# EAGLE design Ver1.0 (EAGLE 9.6.2)
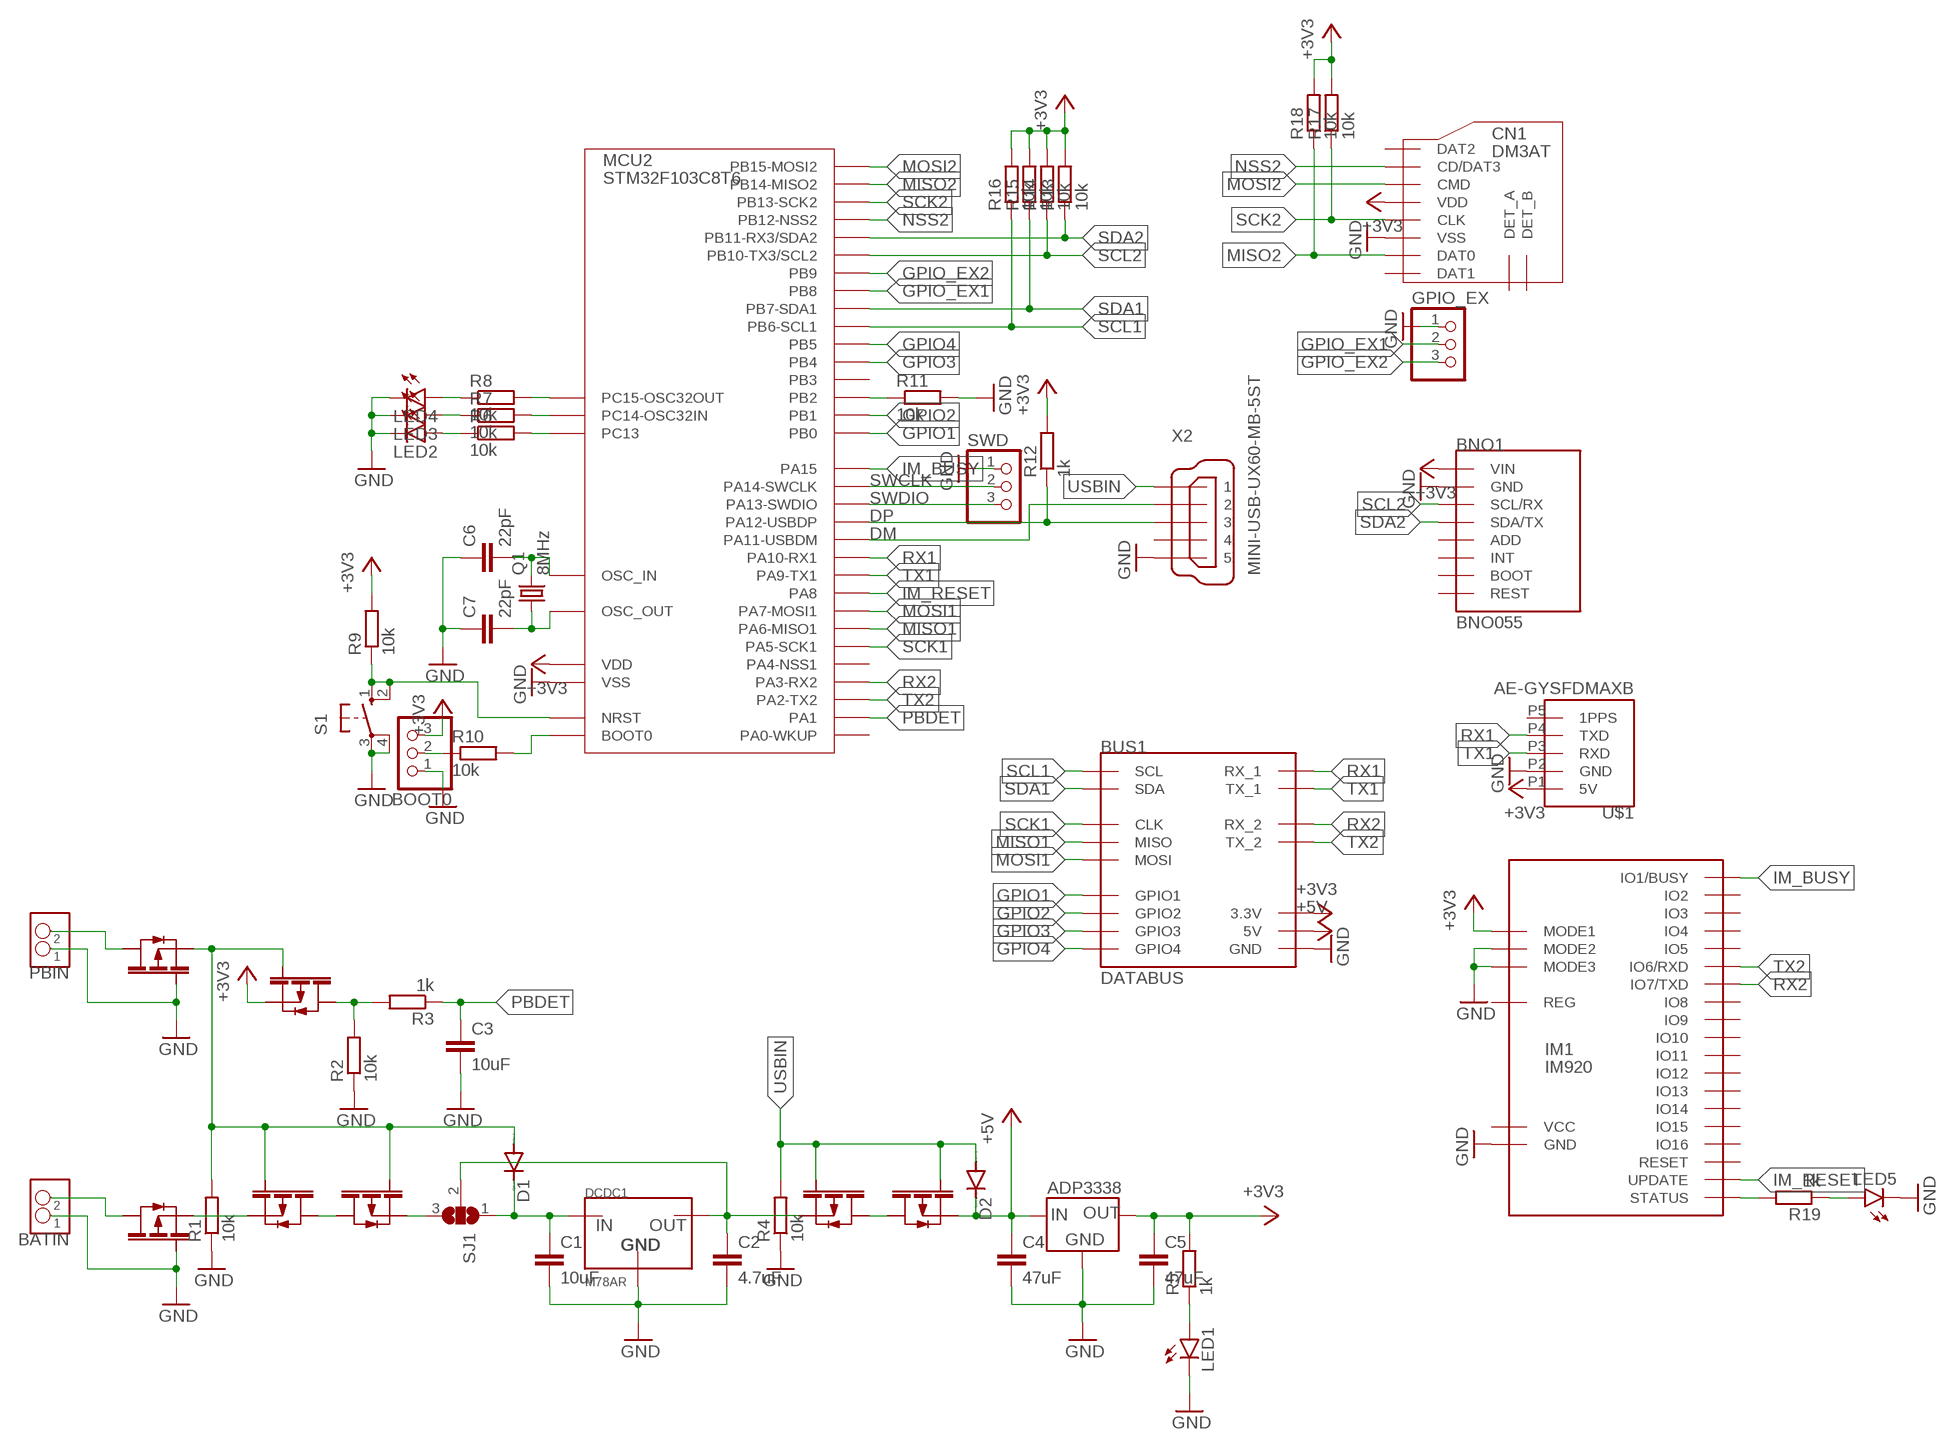
[diagram p0: schematic, sheet 1]

## Parts
BATIN  S2B-XH-A  [S2B-XH-A]
BNO1  BNO055  [BNO055]
BOOT0  PINHD-1X3/90  [1X03/90]
BUS1  DATABUS  [8X2]
C1  10uF  C-EUC2012  [C2012]
C2  4.7uF  C-EUC2012  [C2012]
C3  10uF  C-EUC2012  [C2012]
C4  47uF  C-EUC2012  [C2012]
C5  47uF  C-EUC2012  [C2012]
C6  22pF  C-EUC2012  [C2012]
C7  22pF  C-EUC2012  [C2012]
CN1  DM3AT  [DM3AT]
D1  DIODE-SOD123  [SOD123]
D2  DIODE-SOD123  [SOD123]
DCDC1  M78AR  [M78AR]
FET1  PCH  [SOT-23]
FET2  PCH  [SOT-23]
FET3  PCH  [SOT-23]
FET4  PCH  [SOT-23]
FET5  PCH  [SOT-23]
FET6  PCH  [SOT-23]
FET7  PCH  [SOT-23]
GPIO_EX  PINHD-1X3  [1X03]
IC1  ADP3338-3.3  [SOT-223]
IM1  IM920  [IM920]
LED1  LEDSMT1206  [1206]
LED2  LEDSMT1206  [1206]
LED3  LEDSMT1206  [1206]
LED4  LEDSMT1206  [1206]
LED5  LEDSMT1206  [1206]
MCU2  STM32F103C8T6  [LQFP48]
PBIN  S2B-XH-A  [S2B-XH-A]
Q1  8MHz  CRYSTALHC49S  [HC49/S]
R1  10k  R-EU_R2012  [R2012]
R2  10k  R-EU_R2012  [R2012]
R3  1k  R-EU_R2012  [R2012]
R4  10k  R-EU_R2012  [R2012]
R5  1k  R-EU_R2012  [R2012]
R6  10k  R-EU_R2012  [R2012]
R7  10k  R-EU_R2012  [R2012]
R8  10k  R-EU_R2012  [R2012]
R9  10k  R-EU_R2012  [R2012]
R10  10k  R-EU_R2012  [R2012]
R11  10k  R-EU_R2012  [R2012]
R12  1k  R-EU_R2012  [R2012]
R13  10k  R-EU_R2012  [R2012]
R14  10k  R-EU_R2012  [R2012]
R15  10k  R-EU_R2012  [R2012]
R16  10k  R-EU_R2012  [R2012]
R17  10k  R-EU_R2012  [R2012]
R18  10k  R-EU_R2012  [R2012]
R19  1k  R-EU_R2012  [R2012]
S1  10-XX  [B3F-10XX]
SJ1  SJ2W  [SJ_2]
SWD  PINHD-1X3/90  [1X03/90]
U$1  AE-GYSFDMAXB  [AE-GYSFDMAXB]
X2  MINI-USB-UX60-MB-5ST  [UX60-MB-5ST]

## Nets
+3V3 [POWER]: BNO1.P1(VIN) BOOT0.3 BUS1.P6(3.3V) CN1.VDD FET5.P$2 IM1.IO17(MODE1) MCU2.1(VDD) MCU2.9(VDD) MCU2.24(VDD) MCU2.36(VDD) MCU2.48(VDD) R9.2 R12.2 R13.2 R14.2 R15.2 R16.2 R17.2 R18.2 U$1.P1(5V)
+5V [POWER]: BUS1.P7(5V) C4.1 D2.C FET7.P$2 IC1.3(IN)
BAT_CON_FET [POWER]: BATIN.P$2 FET2.P$3
BAT_FET_FET1 [POWER]: FET2.P$2 FET3.P$2
BAT_FET_FET2 [POWER]: FET3.P$3 FET4.P$3
BAT_JMP_DCDC [POWER]: C1.1 D1.C DCDC1.P3(IN) SJ1.1
BOOT0 [SIGNAL]: MCU2.44(BOOT0) R10.2
BOOT0_R_SEL [SIGNAL]: BOOT0.2 R10.1
DCDC_FET [POWER]: C2.1 DCDC1.P1(OUT) FET6.P$2 SJ1.2
DCDC_FET_FET [POWER]: FET6.P$3 FET7.P$3
DM [SIGNAL]: MCU2.32(PA11-USBDM) X2.2
DP [SIGNAL]: MCU2.33(PA12-USBDP) R12.1 X2.3
GND [GND]: BATIN.P$1 BNO1.P2(GND) BOOT0.1 BUS1.P11(GND) C1.2 C2.2 C3.2 C4.2 C5.2 C6.1 C7.1 CN1.VSS DCDC1.P2(GND) FET1.P$1 FET2.P$1 GPIO_EX.1 IC1.4(GND) IM1.IO18(MODE2) IM1.IO19(MODE3) IM1.IO24(GND) LED1.C LED2.C LED3.C LED4.C LED5.C MCU2.8(VSS) MCU2.23(VSS) MCU2.35(VSS) MCU2.47(VSS) PBIN.P$1 R1.1 R2.1 R4.1 R11.2 S1.3(P) S1.4(P1) SWD.1 U$1.P2(GND) X2.5
GPIO1 [SIGNAL]: BUS1.P3(GPIO1) MCU2.18(PB0)
GPIO2 [SIGNAL]: BUS1.P10(GPIO2) MCU2.19(PB1)
GPIO3 [SIGNAL]: BUS1.P14(GPIO3) MCU2.40(PB4)
GPIO4 [SIGNAL]: BUS1.P15(GPIO4) MCU2.41(PB5)
GPIO_EX1 [SIGNAL]: GPIO_EX.2 MCU2.45(PB8)
GPIO_EX2 [SIGNAL]: GPIO_EX.3 MCU2.46(PB9)
IM_BUSY [SIGNAL]: IM1.IO1(IO1/BUSY) MCU2.38(PA15)
IM_RESET: IM1.IO20(UPDATE) MCU2.29(PA8)
IM_STATUS_LED [SIGNAL]: LED5.A R19.1
IM_STATUS_R [SIGNAL]: IM1.IO21(STATUS) R19.2
MISO1 [SIGNAL]: BUS1.P12(MISO) MCU2.16(PA6-MISO1)
MISO2 [SIGNAL]: CN1.DAT0 MCU2.27(PB14-MISO2) R18.1
MOSI1 [SIGNAL]: BUS1.P2(MOSI) MCU2.17(PA7-MOSI1)
MOSI2 [SIGNAL]: CN1.CMD MCU2.28(PB15-MOSI2)
NRST [SIGNAL]: MCU2.7(NRST) R9.1 S1.1(S) S1.2(S1)
NSS2 [SIGNAL]: CN1.CD/DAT3 MCU2.25(PB12-NSS2)
OSCI_C [SIGNAL]: C6.2 MCU2.5(OSC_IN) Q1.2
OSCO_C [SIGNAL]: C7.2 MCU2.6(OSC_OUT) Q1.1
PB2_R [SIGNAL]: MCU2.20(PB2) R11.1
PB_CON_FET [POWER]: FET1.P$3 PBIN.P$2
PB_FET_DIO [POWER]: D1.A FET1.P$2 FET3.P$1 FET4.P$1 FET5.P$1 R1.2
PB_FET_JMP [POWER]: FET4.P$2 SJ1.3
PBDET [POWER]: C3.1 MCU2.11(PA1) R3.1
PBDET_FET_R [POWER]: FET5.P$3 R2.2 R3.2
PC13_R [SIGNAL]: MCU2.2(PC13) R6.2
PC13_R_LED [SIGNAL]: LED2.A R6.1
PC14_R [SIGNAL]: MCU2.3(PC14-OSC32IN) R7.2
PC14_R_LED [SIGNAL]: LED3.A R7.1
PC15_R [SIGNAL]: MCU2.4(PC15-OSC32OUT) R8.2
PC15_R_LED [SIGNAL]: LED4.A R8.1
POW_R_LED [SIGNAL]: LED1.A R5.1
REG_SW [POWER]: C5.1 IC1.1(OUT) IC1.2(OUT) R5.2 ; supply symbol labelled +3V3
RX1 [SIGNAL]: BUS1.P4(RX_1) MCU2.31(PA10-RX1) U$1.P4(TXD)
RX2 [SIGNAL]: BUS1.P9(RX_2) IM1.IO7(IO7/TXD) MCU2.13(PA3-RX2)
SCK1 [SIGNAL]: BUS1.P1(CLK) MCU2.15(PA5-SCK1)
SCK2 [SIGNAL]: CN1.CLK MCU2.26(PB13-SCK2) R17.1
SCL1 [SIGNAL]: BUS1.P0(SCL) MCU2.42(PB6-SCL1) R16.1
SCL2 [SIGNAL]: BNO1.P3(SCL/RX) MCU2.21(PB10-TX3/SCL2) R14.1
SDA1 [SIGNAL]: BUS1.P13(SDA) MCU2.43(PB7-SDA1) R15.1
SDA2 [SIGNAL]: BNO1.P4(SDA/TX) MCU2.22(PB11-RX3/SDA2) R13.1
SWCLK [SIGNAL]: MCU2.37(PA14-SWCLK) SWD.2
SWDIO [SIGNAL]: MCU2.34(PA13-SWDIO) SWD.3
TX1 [SIGNAL]: BUS1.P5(TX_1) MCU2.30(PA9-TX1) U$1.P3(RXD)
TX2 [SIGNAL]: BUS1.P8(TX_2) IM1.IO6(IO6/RXD) MCU2.12(PA2-TX2)
USBIN [POWER]: D2.A FET6.P$1 FET7.P$1 R4.2 X2.1
Unconnected: BNO1.P5(ADD) BNO1.P6(INT) BNO1.P7(BOOT) BNO1.P8(REST) CN1.DAT1 CN1.DAT2 CN1.DET_A CN1.DET_B IM1.IO2 IM1.IO3 IM1.IO4 IM1.IO5 IM1.IO8 IM1.IO9 IM1.IO10 IM1.IO11 IM1.IO12 IM1.IO13 IM1.IO14 IM1.IO15 IM1.IO16 IM1.IO22(REG) IM1.IO23(VCC) IM1.IO25(RESET) MCU2.10(PA0-WKUP) MCU2.14(PA4-NSS1) MCU2.39(PB3) U$1.P5(1PPS) X2.4

## Library data of the parts
BATIN PBIN = JST-Con:S2B-XH-A
BNO1 = BNO055:BNO055
BOOT0 GPIO_EX SWD = pinhead:PINHD-1X3: PIN HEADER
BUS1 = databus:DATABUS
C1-C7 = rcl:C-EU: CAPACITOR, European symbol; SPICEPREFIX: C
CN1 = microSD:DM3AT
D1 D2 = diode:DIODE-: DIODE
DCDC1 = M78AR:M78AR
FET1-FET7 = MOSFET:PCH
IC1 = ADP3338:ADP3338-3.3
IM1 = IM920:IM920
LED1-LED5 = led:LED: LED OSRAM: - CHIPLED LG R971, LG N971, LY N971, LG Q971, LY Q971, LO R971, LY R971 LH N974, LH R974 LS Q976, LO Q976, LY Q976 LO Q996 - Hyper CHIPLED LW Q18S LB Q993, LB Q99A, LB R99A - SideLED LS A670, LO A670, LY A670, LG A670, LP A670 LB A673, LV A673, LT A673, LW A673 LH A674 LY A675 LS A676, LA A676, LO A676, LY A676, LW A676 LS A679, LY A679, LG A679 - Hyper Micro SIDELED® LS Y876, LA Y876, LO Y876, LY Y876 LT Y87S - SmartLED LW L88C, LW L88S LB L89C, LB L89S, LG L890 LS L89K, LO L89K, LY L89K LS L896, LA L896, LO L896, LY L896 - TOPLED LS T670, LO T670, LY T670, LG T670, LP T670 LSG T670, LSP T670, LSY T670, LOP T670, LYG T670 LG T671, LOG T671, LSG T671 LB T673, LV T673, LT T673, LW T673 LH T674 LS T676, LA T676, LO T676, LY T676, LB T676, LH T676, LSB T676, LW T676 LB T67C, LV T67C, LT T67C, LS T67K, LO T67K, LY T67K, LW E67C LS E67B, LA E67B, LO E67B, LY E67B, LB E67C, LV E67C, LT E67C LW T67C LS T679, LY T679, LG T679 LS T770, LO T770, LY T770, LG T770, LP T770 LB T773, LV T773, LT T773, LW T773 LH T774 LS E675, LA E675, LY E675, LS T675 LS T776, LA T776, LO T776, LY T776, LB T776 LHGB T686 LT T68C, LB T68C - Hyper Mini TOPLED® LB M676 - Mini TOPLED Santana® LG M470 LS M47K, LO M47K, LY M47K Source: http://www.osram.convergy.de LUXEON: - LUMILED® LXK2-PW12-R00, LXK2-PW12-S00, LXK2-PW14-U00, LXK2-PW14-V00 LXK2-PM12-R00, LXK2-PM12-S00, LXK2-PM14-U00 LXK2-PE12-Q00, LXK2-PE12-R00, LXK2-PE12-S00, LXK2-PE14-T00, LXK2-PE14-U00 LXK2-PB12-K00, LXK2-PB12-L00, LXK2-PB12-M00, LXK2-PB14-N00, LXK2-PB14-P00, LXK2-PB14-Q00 LXK2-PR12-L00, LXK2-PR12-M00, LXK2-PR14-Q00, LXK2-PR14-R00 LXK2-PD12-Q00, LXK2-PD12-R00, LXK2-PD12-S00 LXK2-PH12-R00, LXK2-PH12-S00 LXK2-PL12-P00, LXK2-PL12-Q00, LXK2-PL12-R00 Source: www.luxeon.com KINGBRIGHT: KA-3528ASYC Source: www.kingbright.com
MCU2 = STM32F103C8T6:STM32F103C8T6
Q1 = crystal:CRYSTAL: CRYSTAL; OC_FARNELL: 1667008; OC_NEWARK: unknown
R1-R19 = rcl:R-EU_: RESISTOR, European symbol; SPICEPREFIX: R
S1 = switch-omron:10-XX: OMRON SWITCH; MPN: B3F-1000; OC_FARNELL: 176432; OC_NEWARK: 36M3542
SJ1 = jumper:SJ2W: SMD solder JUMPER
U$1 = AE-GYSFDMAXB:AE-GYSFDMAXB
X2 = con-hirose:MINI-USB-: MINI USB Connector Source: http://www.hirose.co.jp/cataloge_hp/e24000019.pdf; OC_FARNELL: unknown; OC_NEWARK: unknown

## Net classes
1 SIGNAL: width 0.152 mm, drill 0.305 mm, clearance 0.152 mm
2 GND: width 0.305 mm, drill 0.305 mm, clearance 0.152 mm
3 POWER: width 0.381 mm, drill 0.305 mm, clearance 0.152 mm

## Board
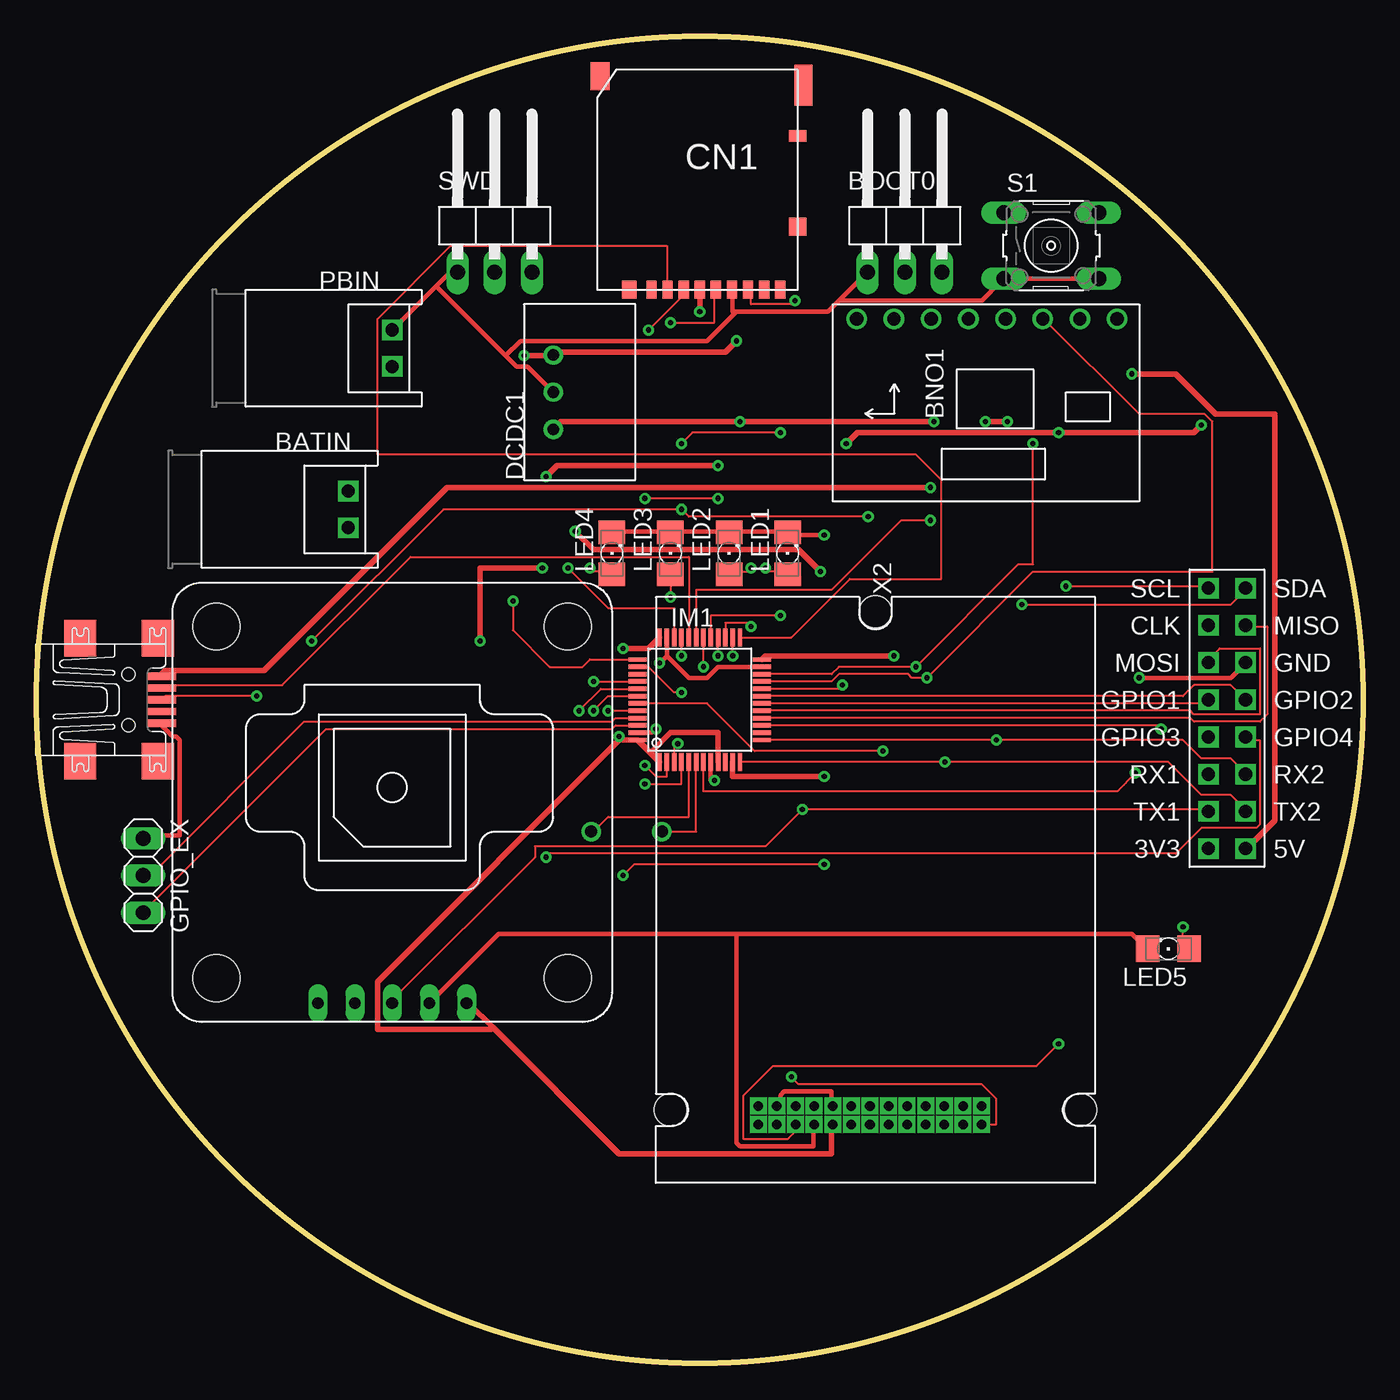
[diagram p1: board, top side]
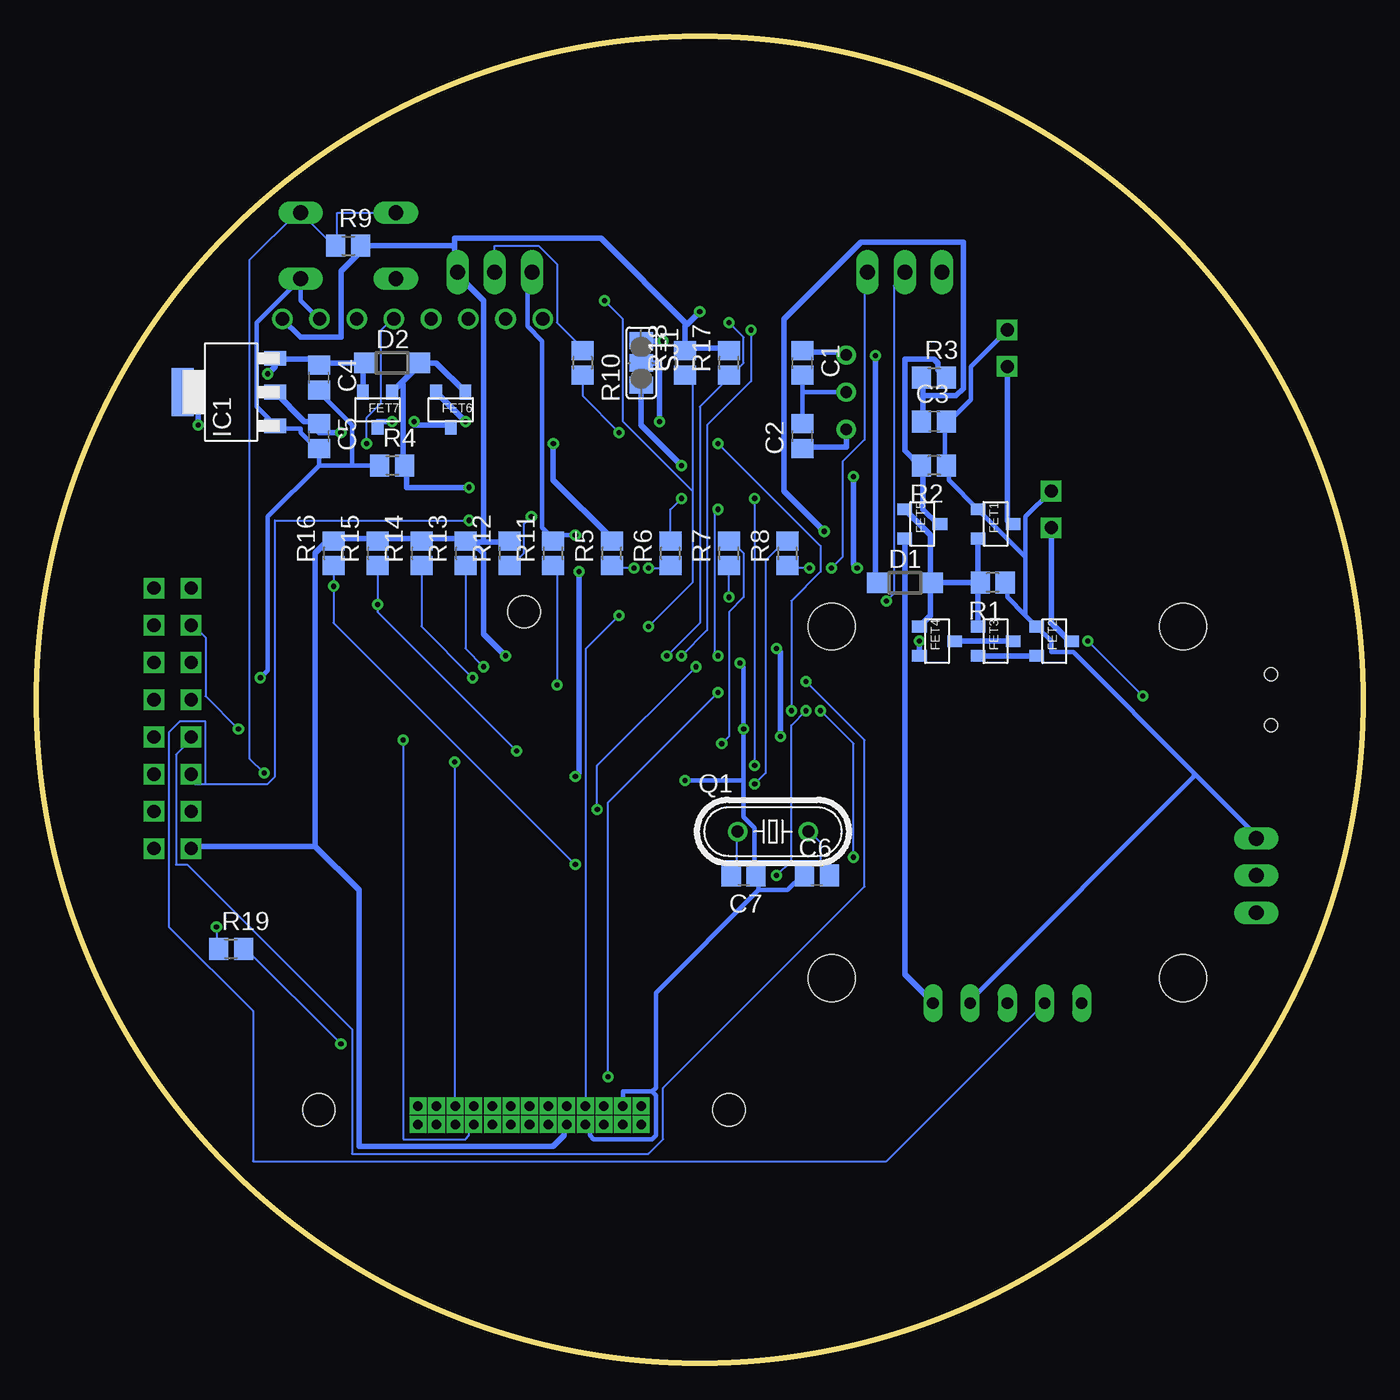
[diagram p2: board, bottom side, seen from below]

Size 90.55 x 90.55 mm. Coordinates in mm from the lower left corner, seen from the top.
Outline: circle at 45.28,45.28 radius 45.28
Copper layers (1*16): Top 0.035mm / dielectric 1.5mm / Bottom 0.035mm
Design rules "default": minimum track width 6mil, minimum drill 0.35mm, track to track 6mil, track to pad 6mil, pad to pad 6mil, via to via 6mil, smd to smd 6mil, copper to edge 40mil, drill to drill 6mil, minimum pad ring 10mil, minimum via ring 8mil, stop-mask expansion 4mil, vias tented up to drill 0mil, thermal gap 10mil

### Footprints (pad centres in the part's own frame; a part is rotated, then mirrored left to right if it is on the bottom)
S2B-XH-A = drill 0.9 square: P$1 0,1.25; P$2 0,-1.25
BNO055 = drill 0.9: P1 -7,11.5; P2 -7,8.96; P3 -7,6.42; P4 -7,3.88; P5 -7,1.34; P6 -7,-1.2; P7 -7,-3.74; P8 -7,-6.28
1X03/90 = drill 1.016 long: 1 -2.54,-3.81; 2 0,-3.81; 3 2.54,-3.81
8X2 = drill 0.9 square: P0 -1.27,7.62; P1 -1.27,5.08; P2 -1.27,2.54; P3 -1.27,0; P4 -1.27,-5.08; P5 -1.27,-7.62; P6 -1.27,-10.16; P7 1.27,-10.16; P8 1.27,-7.62; P9 1.27,-5.08; P10 1.27,0; P11 1.27,2.54; P12 1.27,5.08; P13 1.27,7.62; P14 -1.27,-2.54; P15 1.27,-2.54
C2012 = smd 1.3 x 1.5: 1 -0.85,0; 2 0.85,0
DM3AT = smd 0.7 x 1.2: CD/DAT3 2.2,6; CLK -1.1,6; CMD 1.1,6; DAT0 -3.3,6; DAT1 -4.4,6; DAT2 3.3,6; DET_B -5.5,6; VDD 0,6; VSS -2.2,6 | smd 1.2 x 0.8: DET_A -6.7,-4.5 | smd 1 x 1.2: P$9 4.8,6 | smd 1.2 x 1.2: P$11 -6.7,1.7 | smd 1.2 x 2.8: P$13 -7.081,-7.973 | smd 1.3 x 1.9: P$14 6.8,-8.562
SOD123 = smd 1.4 x 1.4: A 1.9,0; C -1.9,0
M78AR = drill 0.8: P1 -2.54,0; P2 0,0; P3 2.54,0
SOT-23 = smd 0.8 x 1: P$1 -1,0; P$2 1,0; P$3 0,2.4
1X03 = drill 1.016 long: 1 -2.54,0; 2 0,0; 3 2.54,0
SOT-223 = smd 3.3 x 1.5: 1 0,3.3 | smd 1 x 1.5: 2 0,-3; 3 2.3,-3; 4 -2.3,-3
IM920 = drill 0.65 square: IO1 7.24,-16; IO2 7.24,-14.73; IO3 5.97,-16; IO4 5.97,-14.73; IO5 4.7,-16; IO6 4.7,-14.73; IO7 3.43,-16; IO8 3.43,-14.73; IO9 2.16,-16; IO10 2.16,-14.73; IO11 0.89,-16; IO12 0.89,-14.73; IO13 -0.38,-16; IO14 -0.38,-14.73; IO15 -1.65,-16; IO16 -1.65,-14.73; IO17 -2.92,-16; IO18 -2.92,-14.73; IO19 -4.19,-16; IO20 -4.19,-14.73; IO21 -5.46,-16; IO22 -5.46,-14.73; IO23 -6.73,-16; IO24 -6.73,-14.73; IO25 -8,-16; IO26 -8,-14.73 | hole 2.2: -14,-15; 14,-15; 0,19
1206 = smd 1.6 x 1.803: A -1.422,0; C 1.422,0
LQFP48 = smd 0.3 x 1.2: 1 -2.75,-4.25; 2 -2.25,-4.25; 3 -1.75,-4.25; 4 -1.25,-4.25; 5 -0.75,-4.25; 6 -0.25,-4.25; 7 0.25,-4.25; 8 0.75,-4.25; 9 1.25,-4.25; 10 1.75,-4.25; 11 2.25,-4.25; 12 2.75,-4.25; 25 2.75,4.25; 26 2.25,4.25; 27 1.75,4.25; 28 1.25,4.25; 29 0.75,4.25; 30 0.25,4.25; 31 -0.25,4.25; 32 -0.75,4.25; 33 -1.25,4.25; 34 -1.75,4.25; 35 -2.25,4.25; 36 -2.75,4.25 | smd 1.2 x 0.3: 13 4.25,-2.75; 14 4.25,-2.25; 15 4.25,-1.75; 16 4.25,-1.25; 17 4.25,-0.75; 18 4.25,-0.25; 19 4.25,0.25; 20 4.25,0.75; 21 4.25,1.25; 22 4.25,1.75; 23 4.25,2.25; 24 4.25,2.75; 37 -4.25,2.75; 38 -4.25,2.25; 39 -4.25,1.75; 40 -4.25,1.25; 41 -4.25,0.75; 42 -4.25,0.25; 43 -4.25,-0.25; 44 -4.25,-0.75; 45 -4.25,-1.25; 46 -4.25,-1.75; 47 -4.25,-2.25; 48 -4.25,-2.75
HC49/S = drill 0.813: 1 -2.413,0; 2 2.413,0
R2012 = smd 1.3 x 1.5: 1 -0.85,0; 2 0.85,0
B3F-10XX = drill 1.016 long: 1 -3.251,2.261; 2 3.251,2.261; 3 -3.251,-2.261; 4 3.251,-2.261
SJ_2 = smd 1.168 x 1.6: 1 -1.524,0; 2 0,0; 3 1.524,0
AE-GYSFDMAXB = drill 0.8 long: P1 13.716,5.08; P2 13.716,2.54; P3 13.716,0; P4 13.716,-2.54; P5 13.716,-5.08 | hole 3.2: -12,12; 12,12; 12,-12; -12,-12
UX60-MB-5ST = smd 2 x 0.5: 1 2.25,1.6; 2 2.25,0.8; 3 2.25,0; 4 2.25,-0.8; 5 2.25,-1.6 | smd 2.2 x 2.5: M1 -3.3,-4.2; M2 -3.3,4.2; M3 2,4.2; M4 2,-4.2 | hole 0.9: 0,-1.75; 0,1.75

### Placement (x,y rotation side)
BATIN  21.28,58.28 0 top
BNO1  62.28,64.28 270 top
BOOT0  59.28,78.28 0 top
BUS1  81.28,45.28 0 top
C1  38.28,68.28 270 bottom
C2  38.28,63.28 90 bottom
C3  29.28,64.28 0 bottom
C4  71.28,67.28 270 bottom
C5  71.28,63.28 270 bottom
C6  37.28,33.28 0 bottom
C7  42.28,33.28 180 bottom
CN1  45.28,79.28 180 top
D1  31.28,53.28 0 bottom
D2  66.28,68.28 0 bottom
DCDC1  35.28,66.28 90 top
FET1  26.28,57.28 270 bottom
FET2  22.28,49.28 270 bottom
FET3  26.28,49.28 270 bottom
FET4  30.28,49.28 270 bottom
FET5  31.28,57.28 270 bottom
FET6  62.28,66.28 180 bottom
FET7  67.28,66.28 180 bottom
GPIO_EX  7.28,33.28 270 top
IC1  77.28,66.28 90 bottom
IM1  57.28,32.28 0 top
LED1  51.28,55.28 90 top
LED2  47.28,55.28 90 top
LED3  43.28,55.28 90 top
LED4  39.28,55.28 90 top
LED5  77.28,28.28 180 top
MCU2  45.28,45.28 0 top
PBIN  24.28,69.28 0 top
Q1  40.28,36.28 0 bottom
R1  25.28,53.28 180 bottom
R2  29.28,61.28 180 bottom
R3  29.28,67.28 0 bottom
R4  66.28,61.28 0 bottom
R5  51.28,55.28 90 bottom
R6  47.28,55.28 90 bottom
R7  43.28,55.28 90 bottom
R8  39.28,55.28 90 bottom
R9  69.28,76.28 0 bottom
R10  53.28,68.28 270 bottom
R11  55.28,55.28 90 bottom
R12  58.28,55.28 90 bottom
R13  61.28,55.28 90 bottom
R14  64.28,55.28 90 bottom
R15  67.28,55.28 90 bottom
R16  70.28,55.28 90 bottom
R17  43.28,68.28 90 bottom
R18  46.28,68.28 90 bottom
R19  77.28,28.28 0 bottom
S1  69.28,76.28 0 top
SJ1  49.28,68.28 270 bottom
SWD  31.28,78.28 0 top
U$1  24.28,38.28 270 top
X2  6.28,45.28 0 top

### Tracks (layer width: path | path; a pad name or v marks a point on that pad's centre or on a via)
+3V3  (via drill 0.35)
  Top 0.381: 41.9,41.65 MCU2.48 40.03,42.53 v39.78,42.78 39.78,42.53 23.28,26.03 23.28,22.78 31.03,22.78 31.15,22.9 | 41.9,41.65 MCU2.1 | MCU2.9 46.53,43.03 43.28,43.03 41.9,41.65 | MCU2.36 41.78,48.78 v40.03,48.78 | 31.15,22.9 29.53,24.53 U$1.P1 | 31.15,22.9 39.78,14.28 54.28,14.28 54.28,16.28 IM1.IO17 | v45.28,71.78 CN1.VDD | MCU2.24 49.78,48.28 v58.53,48.28
  Bottom 0.381: v40.03,48.78 39.78,48.53 v39.78,42.78 | FET5.P$2 31.28,26.53 29.53,24.78 U$1.P1 | 46.15,70.9 46.28,70.78 46.28,69.28 | 46.15,70.9 v45.28,71.78 | 46.28,69.28 43.28,69.28 R17.2 | 46.28,69.28 R18.2 | 62.03,76.28 R9.2 68.53,76.28 68.53,75.78 69.78,74.53 69.78,70.03 72.53,70.03 BNO1.P1 | 62.03,76.28 62.03,74.53 BOOT0.3 61.78,74.28 60.03,72.53 60.03,56.03 | 46.15,70.9 52.03,76.78 62.03,76.78 62.03,76.28 | v58.53,48.28 60.03,49.78 60.03,55.28 60.65,55.9 | 60.65,55.9 60.78,56.03 61.28,56.03 R13.2 61.28,56.28 64.28,56.28 | 60.03,56.03 60.53,56.03 60.65,55.9 | 60.03,56.03 58.28,56.03 R12.2 | 64.28,56.28 67.28,56.28 | 64.28,56.28 R14.2 | 67.28,56.28 70.28,56.28 R16.2 70.28,56.03 70.78,56.03 71.53,55.28 71.53,35.28 | 67.28,56.28 R15.2 | 71.53,35.28 79.78,35.28 BUS1.P6 | 71.53,35.28 68.53,32.28 68.53,14.78 55.28,14.78 54.53,15.53 54.53,16.28 IM1.IO17
+5V  (via drill 0.35)
  Top 0.381: v74.78,67.53 77.78,67.53 80.53,64.78 84.53,64.78 84.53,37.03 82.78,35.28 BUS1.P7
  Bottom 0.381: 68.28,68.28 FET7.P$2 | 68.28,68.28 71.28,68.28 | 68.28,68.28 D2.C | 74.28,68.53 71.28,68.53 71.28,68.28 | 71.28,68.28 C4.1 | v74.78,67.53 74.28,68.03 74.28,68.53 | 74.28,68.53 IC1.3
BAT_CON_FET
  Bottom 0.381: BATIN.P$2 21.28,50.53 20.03,49.28 FET2.P$3
BAT_FET_FET1
  Bottom 0.381: FET3.P$2 FET2.P$2
BAT_FET_FET2
  Bottom 0.381: FET4.P$3 FET3.P$3
BAT_JMP_DCDC  (via drill 0.35)
  Top 0.381: v33.28,68.78 35.28,68.78 DCDC1.P3 35.28,69.03 47.03,69.03 v47.78,69.78
  Bottom 0.381: v33.28,68.78 33.28,53.28 D1.C | C1.1 38.28,69.03 35.28,69.03 DCDC1.P3 | v47.78,69.78 49.28,69.78 SJ1.1
BOOT0  (via drill 0.35)
  Top 0.152: v39.03,44.53 MCU2.44 | v44.03,62.78 44.78,63.53 v50.78,63.53
  Bottom 0.152: v39.03,44.53 39.03,52.03 37.03,54.03 37.03,55.78 v44.03,62.78 | v50.78,63.53 53.28,66.03 R10.2
BOOT0_R_SEL
  Bottom 0.152: BOOT0.2 59.28,76.28 56.28,76.28 55.03,75.03 55.03,71.03 53.28,69.28 R10.1
DCDC_FET  (via drill 0.35)
  Top 0.381: v61.28,64.28 v48.03,64.28 35.78,64.28 35.28,63.78 DCDC1.P1
  Bottom 0.381: v61.28,64.28 FET6.P$2 | DCDC1.P1 35.28,62.53 38.28,62.53 C2.1 | SJ1.2 48.03,68.28 v48.03,64.28
DCDC_FET_FET  (via drill 0.35)
  Top 0.381: v66.28,64.28 v64.78,64.28
  Bottom 0.381: v64.78,64.28 64.78,64.03 62.28,64.03 FET6.P$3 | v66.28,64.28 67.28,64.28 FET7.P$3
DM
  Top 0.152: MCU2.32 44.53,55.03 25.53,55.03 16.78,46.28 8.53,46.28 X2.2
DP  (via drill 0.35)
  Top 0.152: v44.03,48.28 MCU2.33 | v56.78,57.78 44.53,57.78 v44.03,58.28 27.78,58.28 v18.78,49.28 | X2.3 8.78,45.53 v15.03,45.53
  Bottom 0.152: v44.03,48.28 44.28,48.53 44.28,58.03 v44.03,58.28 | v56.78,57.78 57.28,57.28 57.28,55.28 58.28,54.28 R12.1 | v18.78,49.28 v15.03,45.53
GND  (via drill 0.35)
  Top 0.305: IM1.IO18 54.28,17.78 54.28,18.53 51.03,18.53 50.78,18.28 50.78,17.78 IM1.IO24 | MCU2.23 46.53,47.53 45.78,46.78 44.53,46.78 43.03,48.28 | MCU2.35 43.03,48.28 | MCU2.8 46.03,39.78 v46.28,39.78 | MCU2.47 42.03,43.03 v42.28,43.28 | v42.53,47.78 43.03,48.28 | 47.78,29.28 31.53,29.28 27.03,24.78 U$1.P2 | 47.78,29.28 74.78,29.28 75.78,28.28 LED5.C | 47.78,29.28 47.78,15.03 48.03,14.78 53.03,14.78 53.03,16.28 IM1.IO19 | 27.28,73.53 28.03,74.28 28.53,74.28 SWD.1 | 27.28,73.53 PBIN.P$1 | DCDC1.P2 33.53,68.03 32.78,68.03 32.03,68.78 | 27.28,73.53 32.03,68.78 | X2.5 8.53,43.53 9.28,42.78 9.53,42.78 9.78,42.53 9.78,36.03 7.28,36.03 GPIO_EX.1 | v75.28,46.78 81.53,46.78 82.53,47.78 BUS1.P11 | S1.4 S1.3 65.78,73.78 64.53,72.53 54.78,72.53 | 43.28,56.78 39.28,56.78 LED4.C | 43.28,56.78 47.28,56.78 | 43.28,56.78 LED3.C | 47.28,56.78 51.28,56.78 LED1.C 51.28,56.53 v53.78,56.53 | 47.28,56.78 LED2.C | 47.78,71.78 54.03,71.78 54.78,72.53 | 47.78,71.78 47.53,71.78 47.53,73.28 CN1.VSS | 54.78,72.53 56.53,74.28 BOOT0.1 | 32.03,68.78 33.03,69.78 45.78,69.78 47.78,71.78
  Bottom 0.305: 48.53,18.53 48.28,18.28 48.28,15.53 48.53,15.28 52.53,15.28 52.78,15.53 52.78,16.03 53.03,16.28 IM1.IO19 | 48.53,18.53 50.53,18.53 50.53,17.78 IM1.IO24 | 42.28,39.78 v46.28,39.78 | 42.28,39.78 42.28,37.28 41.53,36.53 41.53,33.28 C7.1 41.28,33.28 41.28,32.28 | 42.28,39.78 v42.28,43.28 42.28,47.53 v42.53,47.78 | 41.28,32.28 39.28,32.28 38.28,33.28 C6.1 | 48.53,18.53 48.28,18.78 48.28,25.28 41.28,32.28 | C1.2 38.28,66.28 | 38.28,66.28 C2.2 | DCDC1.P2 38.28,66.28 | 23.03,51.03 24.28,52.28 24.28,53.28 R1.1 | 23.03,51.03 FET2.P$1 21.28,49.28 21.28,48.53 19.78,48.53 11.53,40.28 | BATIN.P$1 23.03,57.78 23.03,55.03 | 23.03,51.03 23.03,55.03 | 23.03,55.03 FET1.P$1 28.28,60.28 28.28,61.28 R2.1 28.53,61.28 28.53,64.28 C3.2 28.28,64.28 26.78,65.78 26.78,68.03 PBIN.P$1 | 11.53,40.28 7.28,36.03 GPIO_EX.1 | 71.28,61.28 69.03,61.28 | 69.03,61.28 R4.1 | 71.28,62.28 71.28,61.28 | 71.28,62.28 72.53,63.53 72.53,63.78 74.28,63.78 IC1.4 74.28,64.03 75.53,65.28 75.53,71.03 72.78,73.78 S1.4 72.53,73.78 72.53,72.53 71.28,71.28 BNO1.P2 | 71.28,62.28 C5.2 | 69.03,61.28 69.03,64.03 71.28,66.28 C4.2 | v75.28,46.78 74.78,47.28 74.78,57.78 71.28,61.28 | 55.53,56.53 56.03,57.03 56.03,69.78 57.03,70.78 57.03,74.03 56.78,74.28 BOOT0.1 | 55.53,56.53 55.28,56.28 R11.2 55.53,56.53 | 55.53,56.53 v53.78,56.53 | 11.53,40.28 11.53,40.03 26.78,24.78 U$1.P2
GPIO1
  Top 0.152: MCU2.18 79.53,45.03 79.78,45.28 BUS1.P3
GPIO2
  Top 0.152: MCU2.19 78.28,45.53 79.03,46.28 81.53,46.28 82.53,45.28 BUS1.P10
GPIO3  (via drill 0.35)
  Top 0.152: v38.03,46.53 MCU2.40
  Bottom 0.152: v38.03,46.53 34.03,42.53 34.03,32.53 47.78,18.78 47.78,15.28 48.78,14.28 69.03,14.28 69.03,22.78 80.28,34.03 81.03,34.03 81.03,41.53 80.03,42.53 BUS1.P14
GPIO4  (via drill 0.35)
  Top 0.152: MCU2.41 38.53,46.03 v37.03,44.53 | v34.78,34.53 35.03,34.78 77.78,34.78 79.53,36.53 83.28,36.53 83.53,36.78 83.53,42.53 82.78,42.53 BUS1.P15
  Bottom 0.152: v37.03,44.53 34.78,42.28 v34.78,34.53
GPIO_EX1
  Top 0.152: MCU2.45 39.53,44.03 39.28,43.78 18.28,43.78 7.78,33.28 GPIO_EX.2
GPIO_EX2
  Top 0.152: MCU2.46 39.53,43.53 39.28,43.28 19.78,43.28 7.28,30.78 GPIO_EX.3
IM_BUSY  (via drill 0.35)
  Top 0.152: MCU2.38 41.78,47.53 43.53,45.78 v44.03,45.78 | v51.53,19.53 52.03,19.03 64.53,19.03 65.53,18.03 65.53,16.28 IM1.IO1
  Bottom 0.152: v44.03,45.78 51.53,38.28 v51.53,19.53
IM_RESET  (via drill 0.35)
  Top 0.152: MCU2.29 46.03,51.03 v50.78,51.03
  Bottom 0.152: v50.78,51.03 53.03,48.78 53.03,17.78 IM1.IO20
IM_STATUS_LED  (via drill 0.35)
  Top 0.152: v78.28,29.78 78.28,28.28 LED5.A
  Bottom 0.152: v78.28,29.78 78.28,28.28 R19.1
IM_STATUS_R  (via drill 0.35)
  Top 0.152: v69.78,21.78 68.28,20.28 50.28,20.28 48.28,18.28 48.28,15.28 51.28,15.28 51.78,15.78 51.78,16.28 IM1.IO21
  Bottom 0.152: v69.78,21.78 76.28,28.28 R19.2
MISO1
  Top 0.152: MCU2.16 78.78,44.03 79.03,43.78 83.53,43.78 84.03,44.28 84.03,50.28 82.78,50.28 BUS1.P12
MISO2  (via drill 0.35)
  Top 0.152: MCU2.27 47.03,50.53 48.53,50.53 v48.78,50.28 | v51.78,72.53 51.53,72.28 48.78,72.28 48.78,73.28 CN1.DAT0
  Bottom 0.152: v48.78,50.28 45.78,53.28 45.78,59.53 | 45.78,59.53 45.78,66.78 46.28,67.28 R18.1 | v51.78,72.53 50.53,71.28 50.53,64.28 45.78,59.53
MOSI1
  Top 0.152: MCU2.17 78.78,44.53 79.03,44.28 83.53,44.28 83.53,48.78 80.78,48.78 80.03,48.03 BUS1.P2
MOSI2  (via drill 0.35)
  Top 0.152: v46.53,48.28 MCU2.28 | v41.78,70.53 44.03,72.78 44.03,73.28 CN1.CMD
  Bottom 0.152: v46.53,48.28 44.78,50.03 44.78,64.03 41.78,67.03 v41.78,70.53
NRST  (via drill 0.35)
  Top 0.152: MCU2.7 45.53,39.03 73.78,39.03 v75.03,40.28
  Bottom 0.152: v75.03,40.28 76.03,41.28 76.03,75.28 72.78,78.53 S1.2 70.28,76.28 R9.1 70.03,76.28 70.03,78.53 S1.1
NSS2
  Top 0.152: MCU2.25 51.53,49.53 55.53,53.53 61.78,53.53 61.78,60.28 60.03,62.03 23.28,62.03 23.28,71.28 28.28,76.28 43.03,76.28 43.03,73.28 CN1.CD/DAT3
OSCI_C
  Top 0.152: MCU2.5 44.53,37.28 39.03,37.28 38.03,36.28 Q1.2
  Bottom 0.152: C6.2 36.53,33.28 37.03,33.78 37.03,35.53 37.78,36.28 Q1.2
OSCO_C
  Top 0.152: MCU2.6 45.03,36.28 Q1.1
  Bottom 0.152: C7.2 43.03,33.28 42.78,33.53 42.78,36.28 Q1.1
PB2_R  (via drill 0.35)
  Top 0.152: MCU2.20 54.78,46.03 v55.03,46.28
  Bottom 0.152: v55.03,46.28 55.03,54.03 55.28,54.28 R11.1
PB_CON_FET
  Bottom 0.381: PBIN.P$2 24.28,57.53 24.03,57.28 FET1.P$3
PB_FET_DIO
  Bottom 0.381: 26.28,53.28 FET3.P$1 | 26.28,53.28 FET1.P$2 | FET4.P$1 29.53,51.03 29.53,53.28 | FET5.P$1 29.53,56.53 29.53,53.28 | 29.53,53.28 D1.A 26.28,53.28 | 26.28,53.28 R1.2
PB_FET_JMP  (via drill 0.35)
  Top 0.381: v30.28,49.28 30.28,54.28 v34.53,54.28 | v34.78,60.53 35.53,61.28 v46.53,61.28
  Bottom 0.381: v30.28,49.28 FET4.P$2 | v34.53,54.28 34.78,54.53 v34.78,60.53 | v46.53,61.28 49.28,64.03 SJ1.3
PBDET  (via drill 0.35)
  Top 0.381: MCU2.11 47.53,40.03 v53.78,40.03 | v53.53,54.03 52.03,55.53 38.03,55.53 v36.78,56.78
  Bottom 0.381: v53.78,40.03 53.53,40.28 v53.53,54.03 | v36.78,56.78 39.53,59.53 39.53,71.28 34.28,76.53 27.28,76.53 27.28,66.53 27.78,66.03 30.03,66.03 | 30.03,66.03 30.03,67.28 R3.1 | 30.03,66.03 30.03,64.28 C3.1
PBDET_FET_R
  Bottom 0.381: FET5.P$3 29.03,57.28 30.03,58.28 30.03,61.28 R2.2 30.28,61.28 31.28,62.28 31.28,68.53 29.28,68.53 29.03,68.28 29.03,67.78 28.53,67.28 R3.2
PC13_R  (via drill 0.35)
  Top 0.152: MCU2.2 43.03,40.03 42.28,40.03 v41.53,40.78 | v46.53,59.03 v41.53,59.03
  Bottom 0.152: v41.53,59.03 v41.53,40.78 | v46.53,59.03 47.28,58.28 R6.2
PC13_R_LED  (via drill 0.35)
  Top 0.152: v48.78,54.28 48.53,54.03 47.28,54.03 LED2.A
  Bottom 0.152: v48.78,54.28 47.28,54.28 R6.1
PC14_R  (via drill 0.35)
  Top 0.152: MCU2.3 43.53,42.28 v43.78,42.28
  Bottom 0.152: v43.78,42.28 43.28,42.78 43.28,51.28 42.28,52.28 42.28,55.28 43.28,56.28 R7.2
PC14_R_LED  (via drill 0.35)
  Top 0.152: LED3.A v43.28,52.28
  Bottom 0.152: v43.28,52.28 R7.1
PC15_R  (via drill 0.35)
  Top 0.152: MCU2.4 44.03,39.53 v41.53,39.53
  Bottom 0.152: v41.53,39.53 40.78,40.28 40.78,54.78 39.28,56.28 R8.2
PC15_R_LED  (via drill 0.35)
  Top 0.152: v37.78,54.28 38.03,54.03 39.28,54.03 LED4.A
  Bottom 0.152: v37.78,54.28 39.28,54.28 R8.1
POW_R_LED  (via drill 0.35)
  Top 0.152: v49.78,54.28 50.03,54.03 51.28,54.03 LED1.A
  Bottom 0.152: v49.78,54.28 51.28,54.28 R5.1
REG_SW  (via drill 0.35)
  Top 0.381: v55.28,62.78 56.03,63.53 v69.78,63.53 79.03,63.53 v79.53,64.03
  Bottom 0.381: v55.28,62.78 55.28,60.28 51.28,56.28 R5.2 | v69.78,63.53 71.28,63.53 C5.1 71.28,64.28 72.28,64.28 IC1.2 | v79.53,64.03 79.53,65.28 80.53,66.28 IC1.1
RX1  (via drill 0.35)
  Top 0.152: MCU2.31 45.03,52.78 54.28,52.78 59.03,57.53 v61.03,57.53
  Bottom 0.152: v61.03,57.53 74.28,57.53 74.28,40.03 74.78,39.53 79.03,39.53 | 79.03,39.53 79.78,39.53 79.78,40.03 BUS1.P4 | 79.03,39.53 79.03,43.78 80.78,43.78 81.53,43.03 81.53,29.78 75.78,24.03 75.78,13.78 32.53,13.78 21.78,24.53 U$1.P4
RX2  (via drill 0.35)
  Top 0.152: MCU2.13 v65.53,42.53 78.28,42.53 79.53,41.28 81.53,41.28 82.53,40.28 BUS1.P9
  Bottom 0.152: v65.53,42.53 65.53,15.28 61.28,15.28 61.03,15.53 61.03,16.03 60.78,16.28 IM1.IO7
SCK1  (via drill 0.35)
  Top 0.152: MCU2.15 76.53,43.53 v76.78,43.28
  Bottom 0.152: v76.78,43.28 79.03,45.53 79.03,49.53 79.78,50.28 BUS1.P1
SCK2  (via drill 0.35)
  Top 0.152: v43.28,71.03 46.28,71.03 46.28,73.28 CN1.CLK | v47.53,48.28 MCU2.26
  Bottom 0.152: v43.28,71.03 42.28,70.03 42.28,68.28 43.28,67.28 | v47.53,48.28 45.28,50.53 45.28,65.28 43.28,67.28 | 43.28,67.28 R17.1
SCL1  (via drill 0.35)
  Top 0.152: MCU2.42 39.03,45.53 v38.03,44.53 | v40.03,33.28 40.78,34.03 v53.78,34.03 | v70.28,53.03 79.78,53.03 BUS1.P0
  Bottom 0.152: v38.03,44.53 39.03,43.53 39.03,34.28 v40.03,33.28 | v53.78,34.03 70.28,50.53 v70.28,53.03 R16.1
SCL2  (via drill 0.35)
  Top 0.152: MCU2.21 54.28,46.53 54.78,47.03 59.53,47.03 59.78,46.78 v60.78,46.78 68.03,54.03 80.28,54.03 80.28,64.28 79.78,64.78 75.28,64.78 68.78,71.28 BNO1.P3
  Bottom 0.152: v60.78,46.78 64.28,50.28 R14.1
SDA1  (via drill 0.35)
  Top 0.152: MCU2.43 45.78,45.03 49.03,41.78 v57.78,41.78 | v67.28,51.78 81.53,51.78 82.53,52.78 BUS1.P13
  Bottom 0.152: v57.78,41.78 67.28,51.28 v67.28,51.78 R15.1
SDA2  (via drill 0.35)
  Top 0.152: MCU2.22 54.28,47.03 54.78,47.53 v60.03,47.53 67.03,54.53 68.03,54.53 v68.03,62.78
  Bottom 0.152: v60.03,47.53 61.28,48.78 R13.1 | v68.03,62.78 68.03,64.53 67.03,65.53 67.03,70.53 66.28,71.28 BNO1.P4
SWCLK  (via drill 0.35)
  Top 0.152: MCU2.37 37.78,48.03 37.28,47.53 35.03,47.53 32.53,50.03 v32.53,52.03
  Bottom 0.152: v32.53,52.03 32.03,52.53 32.03,73.53 31.28,74.28 SWD.2
SWDIO  (via drill 0.35)
  Top 0.152: MCU2.34 43.53,51.53 39.03,51.53 v36.28,54.28
  Bottom 0.152: v36.28,54.28 35.53,55.03 35.53,61.53 34.03,63.03 34.03,74.28 SWD.3
TX1  (via drill 0.35)
  Top 0.152: v45.53,47.53 MCU2.30 | BUS1.P5 79.78,37.78 v52.28,37.78 49.78,35.28 34.03,35.28 34.03,34.53 24.28,24.78 U$1.P3
  Bottom 0.152: v45.53,47.53 52.28,40.78 v52.28,37.78
TX2  (via drill 0.35)
  Top 0.152: MCU2.12 v62.03,41.03 77.28,41.03 79.53,38.78 81.53,38.78 82.53,37.78 BUS1.P8
  Bottom 0.152: v62.03,41.03 62.03,17.78 IM1.IO6
USBIN  (via drill 0.35)
  Top 0.381: v61.03,59.78 28.03,59.78 15.53,47.28 8.78,47.28 8.53,47.03 X2.1
  Bottom 0.381: FET6.P$1 63.28,68.28 D2.A 64.53,68.28 64.53,68.03 65.65,66.9 | 65.65,66.9 FET7.P$1 | 65.65,66.9 65.53,66.78 65.53,61.28 R4.2 65.28,61.28 65.28,59.78 v61.03,59.78